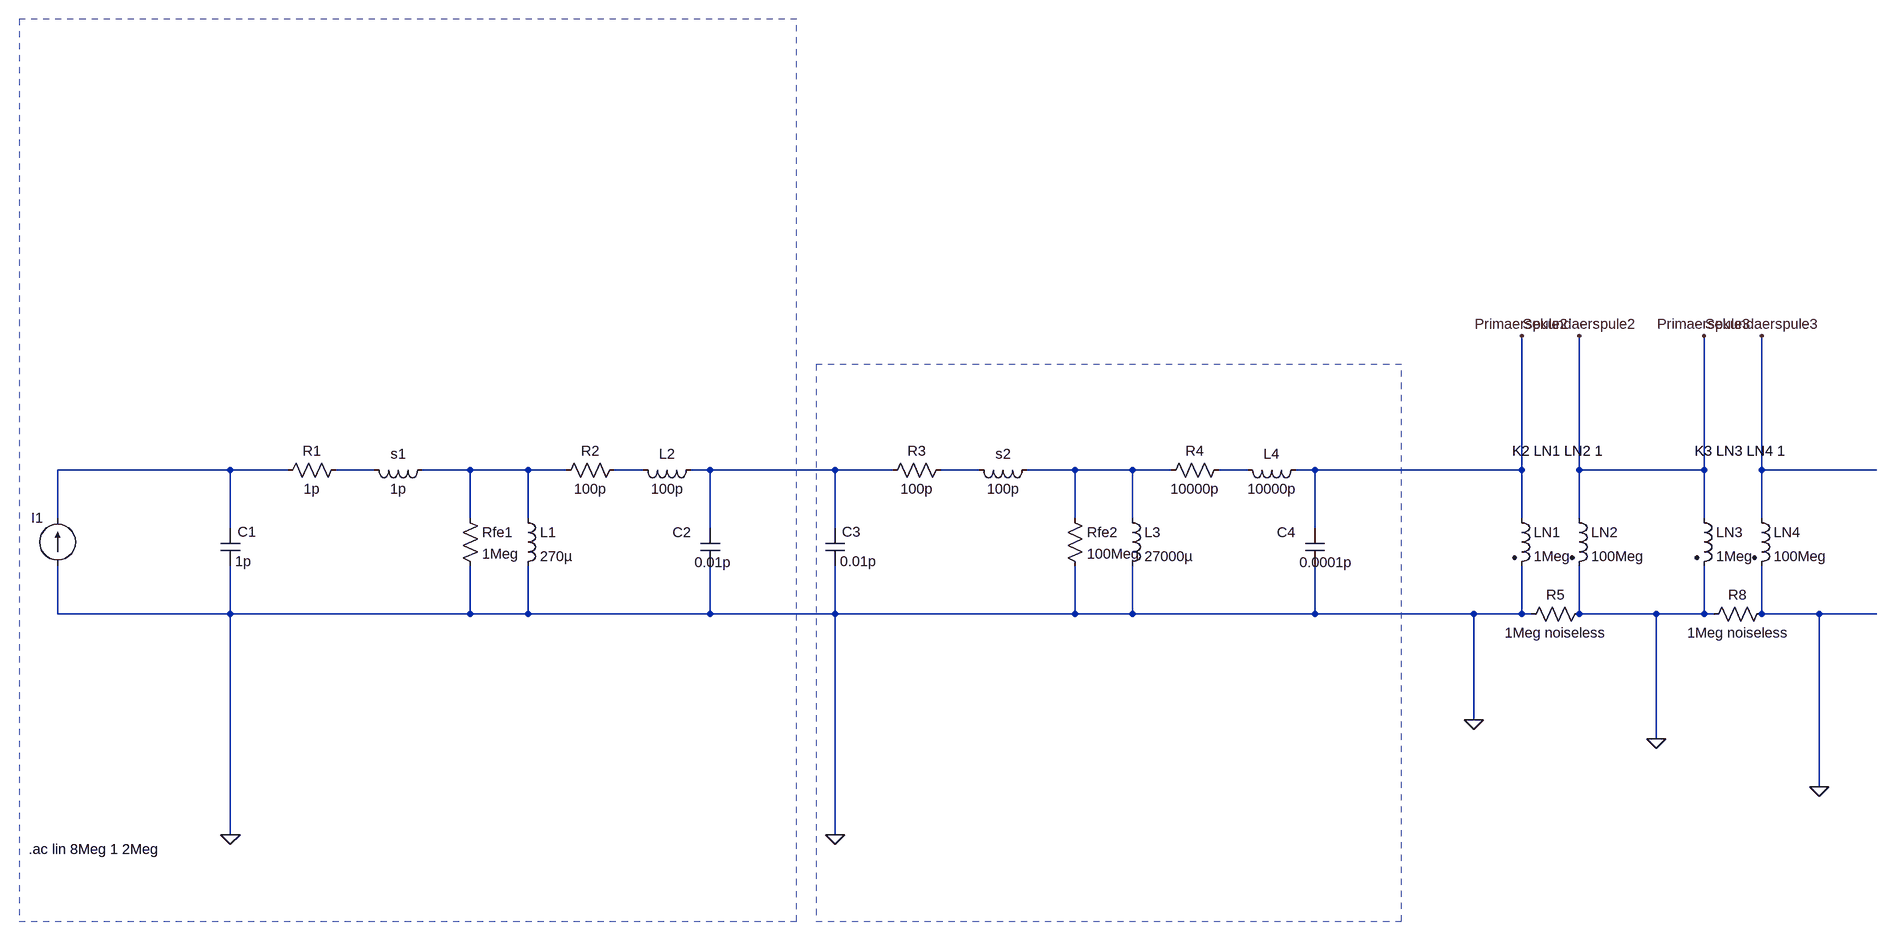
[diagram p0: schematic cascade_simplified.asc]
cascade_simplified.asc, the LTspice schematic file:
Version 4
SHEET 1 4948 1444
WIRE 864 688 576 688
WIRE 960 688 864 688
WIRE 1104 688 1040 688
WIRE 1264 688 1184 688
WIRE 1360 688 1264 688
WIRE 1424 688 1360 688
WIRE 1552 688 1504 688
WIRE 1664 688 1632 688
WIRE 1872 688 1664 688
WIRE 1968 688 1872 688
WIRE 2112 688 2048 688
WIRE 2272 688 2192 688
WIRE 2368 688 2272 688
WIRE 2432 688 2368 688
WIRE 2560 688 2512 688
WIRE 2672 688 2640 688
WIRE 4352 688 4352 464
WIRE 4352 688 2672 688
WIRE 4448 688 4448 464
WIRE 4656 688 4656 464
WIRE 4656 688 4448 688
WIRE 4752 688 4752 464
WIRE 4944 688 4752 688
WIRE 576 768 576 688
WIRE 1264 768 1264 688
WIRE 1360 768 1360 688
WIRE 2272 768 2272 688
WIRE 2368 768 2368 688
WIRE 4352 768 4352 688
WIRE 4448 768 4448 688
WIRE 4656 768 4656 688
WIRE 4752 768 4752 688
WIRE 864 784 864 688
WIRE 1664 784 1664 688
WIRE 1872 784 1872 688
WIRE 2672 784 2672 688
WIRE 576 928 576 848
WIRE 864 928 864 848
WIRE 864 928 576 928
WIRE 1264 928 1264 848
WIRE 1264 928 864 928
WIRE 1360 928 1360 848
WIRE 1360 928 1264 928
WIRE 1664 928 1664 848
WIRE 1664 928 1360 928
WIRE 1872 928 1872 848
WIRE 1872 928 1664 928
WIRE 2272 928 2272 848
WIRE 2272 928 1872 928
WIRE 2368 928 2368 848
WIRE 2368 928 2272 928
WIRE 2672 928 2672 848
WIRE 2672 928 2368 928
WIRE 4272 928 2672 928
WIRE 4352 928 4352 848
WIRE 4352 928 4272 928
WIRE 4368 928 4352 928
WIRE 4448 928 4448 848
WIRE 4576 928 4448 928
WIRE 4656 928 4656 848
WIRE 4656 928 4576 928
WIRE 4672 928 4656 928
WIRE 4752 928 4752 848
WIRE 4848 928 4752 928
WIRE 4944 928 4848 928
WIRE 4272 1104 4272 928
WIRE 4576 1136 4576 928
WIRE 4848 1216 4848 928
WIRE 864 1296 864 928
WIRE 1872 1296 1872 928
FLAG 864 1296 0
FLAG 4352 464 Primaerspule2
FLAG 4448 464 Sekundaerspule2
FLAG 1872 1296 0
FLAG 4656 464 Primaerspule3
FLAG 4752 464 Sekundaerspule3
FLAG 4272 1104 0
FLAG 4576 1136 0
FLAG 4848 1216 0
SYMBOL cap 848 784 R0
WINDOW 0 28 7 Left 2
SYMATTR InstName C1
SYMATTR Value 1p
SYMBOL res 1056 672 R90
WINDOW 0 0 56 VBottom 2
WINDOW 3 32 56 VTop 2
SYMATTR InstName R1
SYMATTR Value 1p
SYMBOL res 1248 752 R0
SYMATTR InstName Rfe1
SYMATTR Value 1Meg
SYMBOL ind 1200 672 R90
WINDOW 0 5 56 VBottom 2
WINDOW 3 32 56 VTop 2
SYMATTR InstName s1
SYMATTR Value 1p
SYMBOL ind 1344 752 R0
SYMATTR InstName L1
SYMATTR Value 270µ
SYMBOL res 1520 672 R90
WINDOW 0 0 56 VBottom 2
WINDOW 3 32 56 VTop 2
SYMATTR InstName R2
SYMATTR Value 100p
SYMBOL cap 1648 784 R0
WINDOW 0 -47 8 Left 2
WINDOW 3 -10 58 Left 2
SYMATTR InstName C2
SYMATTR Value 0.01p
SYMBOL ind 1648 672 R90
WINDOW 0 5 56 VBottom 2
WINDOW 3 32 56 VTop 2
SYMATTR InstName L2
SYMATTR Value 100p
SYMBOL cap 1856 784 R0
WINDOW 0 28 7 Left 2
SYMATTR InstName C3
SYMATTR Value 0.01p
SYMBOL res 2064 672 R90
WINDOW 0 0 56 VBottom 2
WINDOW 3 32 56 VTop 2
SYMATTR InstName R3
SYMATTR Value 100p
SYMBOL res 2256 752 R0
SYMATTR InstName Rfe2
SYMATTR Value 100Meg
SYMBOL ind 2208 672 R90
WINDOW 0 5 56 VBottom 2
WINDOW 3 32 56 VTop 2
SYMATTR InstName s2
SYMATTR Value 100p
SYMBOL ind 2352 752 R0
SYMATTR InstName L3
SYMATTR Value 27000µ
SYMBOL res 2528 672 R90
WINDOW 0 0 56 VBottom 2
WINDOW 3 32 56 VTop 2
SYMATTR InstName R4
SYMATTR Value 10000p
SYMBOL cap 2656 784 R0
WINDOW 0 -47 8 Left 2
WINDOW 3 -10 58 Left 2
SYMATTR InstName C4
SYMATTR Value 0.0001p
SYMBOL ind2 4336 752 R0
SYMATTR InstName LN1
SYMATTR Value 1Meg
SYMATTR Type ind
SYMATTR SpiceLine Ipk=10000 Rser=0 Rpar=0 Cpar=0
SYMBOL ind2 4432 752 R0
SYMATTR InstName LN2
SYMATTR Value 100Meg
SYMATTR Type ind
SYMBOL ind 2656 672 R90
WINDOW 0 5 56 VBottom 2
WINDOW 3 32 56 VTop 2
SYMATTR InstName L4
SYMATTR Value 10000p
SYMBOL res 4464 912 R90
WINDOW 0 0 56 VBottom 2
WINDOW 3 32 56 VTop 2
SYMATTR InstName R5
SYMATTR Value 1Meg noiseless
SYMBOL ind2 4640 752 R0
SYMATTR InstName LN3
SYMATTR Value 1Meg
SYMATTR Type ind
SYMATTR SpiceLine Ipk=10000 Rser=0 Rpar=0 Cpar=0
SYMBOL ind2 4736 752 R0
SYMATTR InstName LN4
SYMATTR Value 100Meg
SYMATTR Type ind
SYMBOL res 4768 912 R90
WINDOW 0 0 56 VBottom 2
WINDOW 3 32 56 VTop 2
SYMATTR InstName R8
SYMATTR Value 1Meg noiseless
SYMBOL current 576 848 R180
WINDOW 0 24 80 Left 2
WINDOW 3 24 0 Invisible 2
WINDOW 39 0 0 Left 2
SYMATTR InstName I1
SYMATTR Value SINE(0 0)
SYMATTR Value2 AC 1 0
TEXT 4336 656 Left 2 !K2 LN1 LN2 1
TEXT 4640 656 Left 2 !K3 LN3 LN4 1
TEXT 528 1320 Left 2 !.ac lin 8Meg 1 2Meg
RECTANGLE Normal 512 1440 1808 -64 2
RECTANGLE Normal 1840 1440 2816 512 2

The netlist it stands for:
* cascade_simplified.asc
C1 N001 0 1p
R1 N002 N001 1p
Rfe1 N003 0 1Meg
L§s1 N003 N002 1p
L1 N003 0 270µ
R2 N004 N003 100p
C2 N005 0 0.01p
L2 N005 N004 100p
C3 N005 0 0.01p
R3 N006 N005 100p
Rfe2 N007 0 100Meg
L§s2 N007 N006 100p
L3 N007 0 27000µ
R4 N008 N007 10000p
C4 Primaerspule2 0 0.0001p
LN1 Primaerspule2 0 1Meg Ipk=10000 Rser=0 Rpar=0 Cpar=0
LN2 Primaerspule3 0 100Meg
L4 Primaerspule2 N008 10000p
R5 0 0 1Meg noiseless
LN3 Primaerspule3 0 1Meg Ipk=10000 Rser=0 Rpar=0 Cpar=0
LN4 Sekundaerspule3 0 100Meg
R8 0 0 1Meg noiseless
I1 0 N001 SINE(0 0) AC 1 0
K2 LN1 LN2 1
K3 LN3 LN4 1
.ac lin 8Meg 1 2Meg
.backanno
.end